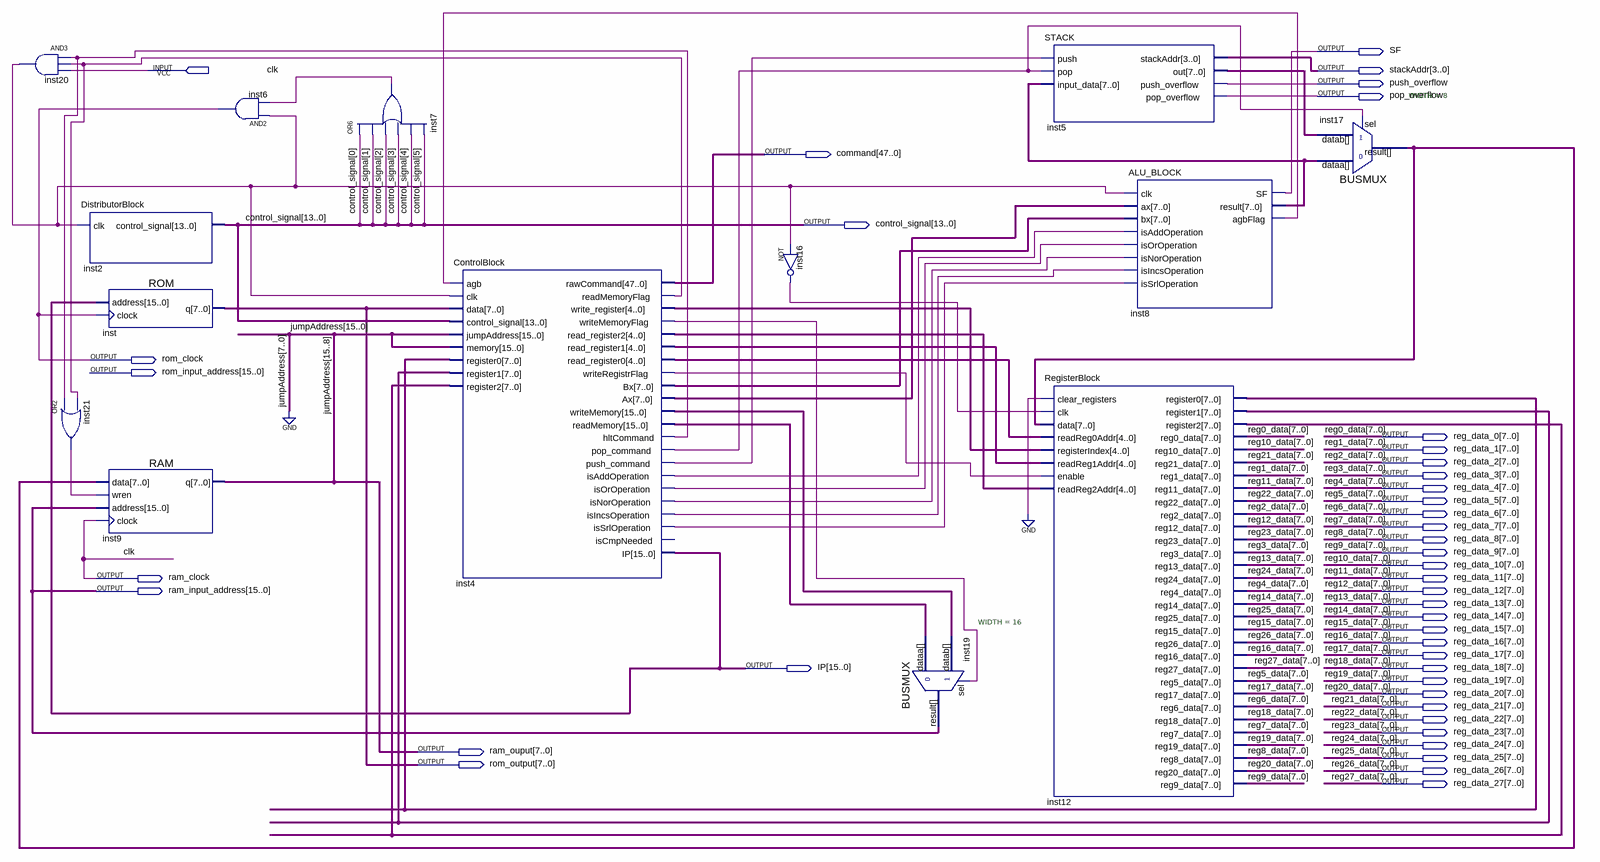
[diagram p0: schematic sheet]
// Quartus schematic MainBlock.bdf as structural Verilog: 14 symbols, 42 pins
module MainBlock (
  input  clk,
  output SF,
  output [3:0] stackAddr,
  output push_overflow,
  output pop_overflow,
  output [47:0] command,
  output [13:0] control_signal,
  output rom_clock,
  output [15:0] rom_input_address,
  output [7:0] reg_data_0,
  output [7:0] reg_data_1,
  output [7:0] reg_data_2,
  output [7:0] reg_data_3,
  output [7:0] reg_data_4,
  output [7:0] reg_data_5,
  output [7:0] reg_data_6,
  output [7:0] reg_data_7,
  output [7:0] reg_data_8,
  output [7:0] reg_data_9,
  output [7:0] reg_data_10,
  output ram_clock,
  output [7:0] reg_data_11,
  output [15:0] ram_input_address,
  output [7:0] reg_data_12,
  output [7:0] reg_data_13,
  output [7:0] reg_data_14,
  output [7:0] reg_data_15,
  output [7:0] reg_data_16,
  output [7:0] reg_data_17,
  output [15:0] IP,
  output [7:0] reg_data_18,
  output [7:0] reg_data_19,
  output [7:0] reg_data_20,
  output [7:0] reg_data_21,
  output [7:0] reg_data_22,
  output [7:0] reg_data_23,
  output [7:0] reg_data_24,
  output [7:0] ram_ouput,
  output [7:0] reg_data_25,
  output [7:0] rom_output,
  output [7:0] reg_data_26,
  output [7:0] reg_data_27
);

  wire inst4_hltcommand, inst4_isaddoperation, inst4_isincsoperation, inst4_isnoroperation,
       inst4_isoroperation, inst4_issrloperation, inst4_pop_command, inst4_push_command,
       inst4_readmemoryflag, inst4_writememoryflag, inst4_writeregistrflag, inst7_out, inst8_agbflag,
       inst16_out, inst20_out, inst21_out;
  wire [4:0] inst4_read_register0, inst4_read_register1, inst4_read_register2, inst4_write_register;
  wire [7:0] inst4_ax, inst4_bx, inst5_out, inst8_result, inst12_register0, inst12_register1,
       inst12_register2, inst17_result;
  wire [15:0] inst4_readmemory, inst4_writememory;

  and inst20 (inst20_out, inst4_hltcommand, inst4_readmemoryflag, clk);
  or inst21 (inst21_out, inst4_hltcommand, inst4_readmemoryflag);
  DistributorBlock inst2 (.clk(inst20_out), .control_signal(control_signal));
  ROM inst (.address(IP), .clock(rom_clock), .q(rom_output));
  RAM inst9 (.data(inst17_result), .wren(inst21_out), .address(ram_input_address), .clock(clk), .q(ram_ouput));
  and inst6 (rom_clock, inst20_out, inst7_out);
  or inst7 (inst7_out, control_signal[0], control_signal[1], control_signal[2], control_signal[3], control_signal[4], control_signal[5]);
  ControlBlock inst4 (
    .agb(inst8_agbflag), .clk(inst20_out), .data(rom_output), .control_signal(control_signal),
    .jumpAddress({ram_ouput, {8{1'b0}}}), .memory({ram_ouput, {8{1'b0}}}), .register0(inst12_register0),
    .register1(inst12_register1), .register2(inst12_register2), .rawCommand(command),
    .readMemoryFlag(inst4_readmemoryflag), .write_register(inst4_write_register),
    .writeMemoryFlag(inst4_writememoryflag), .read_register2(inst4_read_register2),
    .read_register1(inst4_read_register1), .read_register0(inst4_read_register0),
    .writeRegistrFlag(inst4_writeregistrflag), .Bx(inst4_bx), .Ax(inst4_ax), .writeMemory(inst4_writememory),
    .readMemory(inst4_readmemory), .hltCommand(inst4_hltcommand), .pop_command(inst4_pop_command),
    .push_command(inst4_push_command), .isAddOperation(inst4_isaddoperation),
    .isOrOperation(inst4_isoroperation), .isNorOperation(inst4_isnoroperation),
    .isIncsOperation(inst4_isincsoperation), .isSrlOperation(inst4_issrloperation), .IP(IP));  // open: isCmpNeeded
  not inst16 (inst16_out, inst20_out);
  BUSMUX #(.WIDTH(16)) inst19 (
    .datab(inst4_writememory), .sel(inst4_writememoryflag), .dataa(inst4_readmemory),
    .result(ram_input_address));
  STACK inst5 (
    .push(inst4_push_command), .pop(inst4_pop_command), .input_data(inst8_result), .stackAddr(stackAddr),
    .out(inst5_out), .push_overflow(push_overflow), .pop_overflow(pop_overflow));
  RegisterBlock inst12 (
    .clear_registers(1'b0), .clk(inst16_out), .data(inst17_result), .readReg0Addr(inst4_read_register0),
    .registerIndex(inst4_write_register), .readReg1Addr(inst4_read_register1),
    .enable(inst4_writeregistrflag), .readReg2Addr(inst4_read_register2), .register0(inst12_register0),
    .register1(inst12_register1), .register2(inst12_register2), .reg0_data(reg_data_0),
    .reg10_data(reg_data_10), .reg21_data(reg_data_21), .reg1_data(reg_data_1), .reg11_data(reg_data_11),
    .reg22_data(reg_data_22), .reg2_data(reg_data_2), .reg12_data(reg_data_12), .reg23_data(reg_data_23),
    .reg3_data(reg_data_3), .reg13_data(reg_data_13), .reg24_data(reg_data_24), .reg4_data(reg_data_4),
    .reg14_data(reg_data_14), .reg25_data(reg_data_25), .reg15_data(reg_data_15), .reg26_data(reg_data_26),
    .reg16_data(reg_data_16), .reg27_data(reg_data_27), .reg5_data(reg_data_5), .reg17_data(reg_data_17),
    .reg6_data(reg_data_6), .reg18_data(reg_data_18), .reg7_data(reg_data_7), .reg19_data(reg_data_19),
    .reg8_data(reg_data_8), .reg20_data(reg_data_20), .reg9_data(reg_data_9));
  ALU_BLOCK inst8 (
    .clk(inst20_out), .ax(inst4_ax), .bx(inst4_bx), .isAddOperation(inst4_isaddoperation),
    .isOrOperation(inst4_isoroperation), .isNorOperation(inst4_isnoroperation),
    .isIncsOperation(inst4_isincsoperation), .isSrlOperation(inst4_issrloperation), .SF(SF),
    .result(inst8_result), .agbFlag(inst8_agbflag));
  BUSMUX #(.WIDTH(8)) inst17 (.datab(inst5_out), .sel(inst4_pop_command), .dataa(inst8_result), .result(inst17_result));

  assign ram_clock = clk;

  // Other names for the same wires on the sheet: jumpAddress[15:8] = ram_ouput; reg0_data[7:0] = reg_data_0;
  //   reg1_data[7:0] = reg_data_1; reg2_data[7:0] = reg_data_2; reg3_data[7:0] = reg_data_3;
  //   reg4_data[7:0] = reg_data_4; reg5_data[7:0] = reg_data_5; reg6_data[7:0] = reg_data_6;
  //   reg7_data[7:0] = reg_data_7; reg8_data[7:0] = reg_data_8; reg9_data[7:0] = reg_data_9;
  //   reg10_data[7:0] = reg_data_10; reg11_data[7:0] = reg_data_11; reg12_data[7:0] = reg_data_12;
  //   reg13_data[7:0] = reg_data_13; reg14_data[7:0] = reg_data_14; reg15_data[7:0] = reg_data_15;
  //   reg16_data[7:0] = reg_data_16; reg17_data[7:0] = reg_data_17; reg18_data[7:0] = reg_data_18;
  //   reg19_data[7:0] = reg_data_19; reg20_data[7:0] = reg_data_20; reg21_data[7:0] = reg_data_21;
  //   reg22_data[7:0] = reg_data_22; reg23_data[7:0] = reg_data_23; reg24_data[7:0] = reg_data_24;
  //   reg25_data[7:0] = reg_data_25; reg26_data[7:0] = reg_data_26; reg27_data[7:0] = reg_data_27
endmodule
